# EAGLE design power_indicator_right (EAGLE 7.3.0)
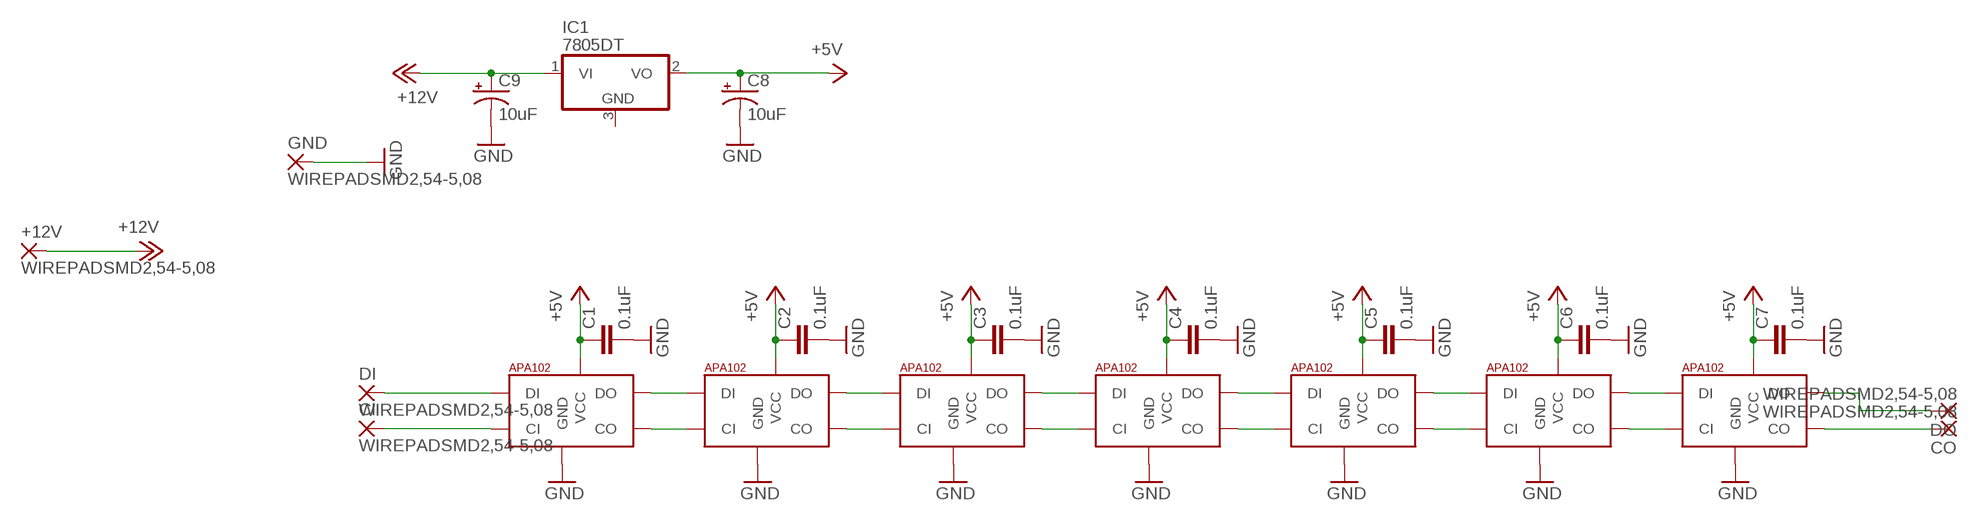
[diagram p0: schematic, sheet 1]

## Parts
+12V  WIREPADSMD2,54-5,08  [SMD2,54-5,08]
C1  0.1uF  0.1UF-100V-10%(0603)  [0603-CAP]
C2  0.1uF  0.1UF-100V-10%(0603)  [0603-CAP]
C3  0.1uF  0.1UF-100V-10%(0603)  [0603-CAP]
C4  0.1uF  0.1UF-100V-10%(0603)  [0603-CAP]
C5  0.1uF  0.1UF-100V-10%(0603)  [0603-CAP]
C6  0.1uF  0.1UF-100V-10%(0603)  [0603-CAP]
C7  0.1uF  0.1UF-100V-10%(0603)  [0603-CAP]
C8  10uF  10UF-TANT  [EIA3216]
C9  10uF  10UF-TANT  [EIA3216]
CI  WIREPADSMD2,54-5,08  [SMD2,54-5,08]
CO  WIREPADSMD2,54-5,08  [SMD2,54-5,08]
DI  WIREPADSMD2,54-5,08  [SMD2,54-5,08]
DO  WIREPADSMD2,54-5,08  [SMD2,54-5,08]
GND  WIREPADSMD2,54-5,08  [SMD2,54-5,08]
IC1  7805DT  [TO252]
U$1  APA1025050  [APA102_5050]
U$2  APA1025050  [APA102_5050]
U$3  APA1025050  [APA102_5050]
U$4  APA1025050  [APA102_5050]
U$5  APA1025050  [APA102_5050]
U$6  APA1025050  [APA102_5050]
U$7  APA1025050  [APA102_5050]

## Nets
+5V: C1.1 C2.1 C3.1 C4.1 C5.1 C6.1 C7.1 C8.A(+) IC1.2(VO) U$1.1(VCC) U$2.1(VCC) U$3.1(VCC) U$4.1(VCC) U$5.1(VCC) U$6.1(VCC) U$7.1(VCC)
+12V: +12V.1(P) C9.A(+) IC1.1(VI)
GND: C1.2 C2.2 C3.2 C4.2 C5.2 C6.2 C7.2 C8.C(-) C9.C(-) GND.1(P) U$1.6(GND) U$2.6(GND) U$3.6(GND) U$4.6(GND) U$5.6(GND) U$6.6(GND) U$7.6(GND)
N$1: U$1.2(CO) U$2.5(CI)
N$2: U$1.3(DO) U$2.4(DI)
N$3: U$2.2(CO) U$3.5(CI)
N$4: U$2.3(DO) U$3.4(DI)
N$5: U$3.2(CO) U$4.5(CI)
N$6: U$3.3(DO) U$4.4(DI)
N$7: U$4.2(CO) U$5.5(CI)
N$8: U$4.3(DO) U$5.4(DI)
N$9: U$5.2(CO) U$6.5(CI)
N$10: U$5.3(DO) U$6.4(DI)
N$11: U$6.2(CO) U$7.5(CI)
N$12: U$6.3(DO) U$7.4(DI)
N$13: CO.1(P) U$7.2(CO)
N$14: DO.1(P) U$7.3(DO)
N$15: DI.1(P) U$1.4(DI)
N$16: CI.1(P) U$1.5(CI)
Unconnected: IC1.3(GND)

## Library data of the parts
+12V CI CO DI DO GND = wirepad:WIREPAD: Wire PAD connect wire on PCB
C1-C7 = SparkFun-Capacitors:0.1UF-100V-10%(0603): CAP-08390; PROD_ID: CAP-08390
C8 C9 = SparkFun-Retired:10UF-TANT: 10uF Tantalum SMT CAP-00811- 16V 10% (EIA-3216); PROD_ID: CAP-00811
IC1 = linear:78*: Positive VOLTAGE REGULATOR Source: http://cache.national.com/ds/LM/LM78L05.pdf http://www.fairchildsemi.com/ds/LM/LM7805.pdf
U$1-U$7 = jos-ph:APA102: APA102C 5050 RGB LED -- Adafruit DotStar Single LED Pixel Product Page: https://www.adafruit.com/products/2343 Datasheet: https://cdn-shop.adafruit.com/product-files/2343/APA102C.pdf

## Board
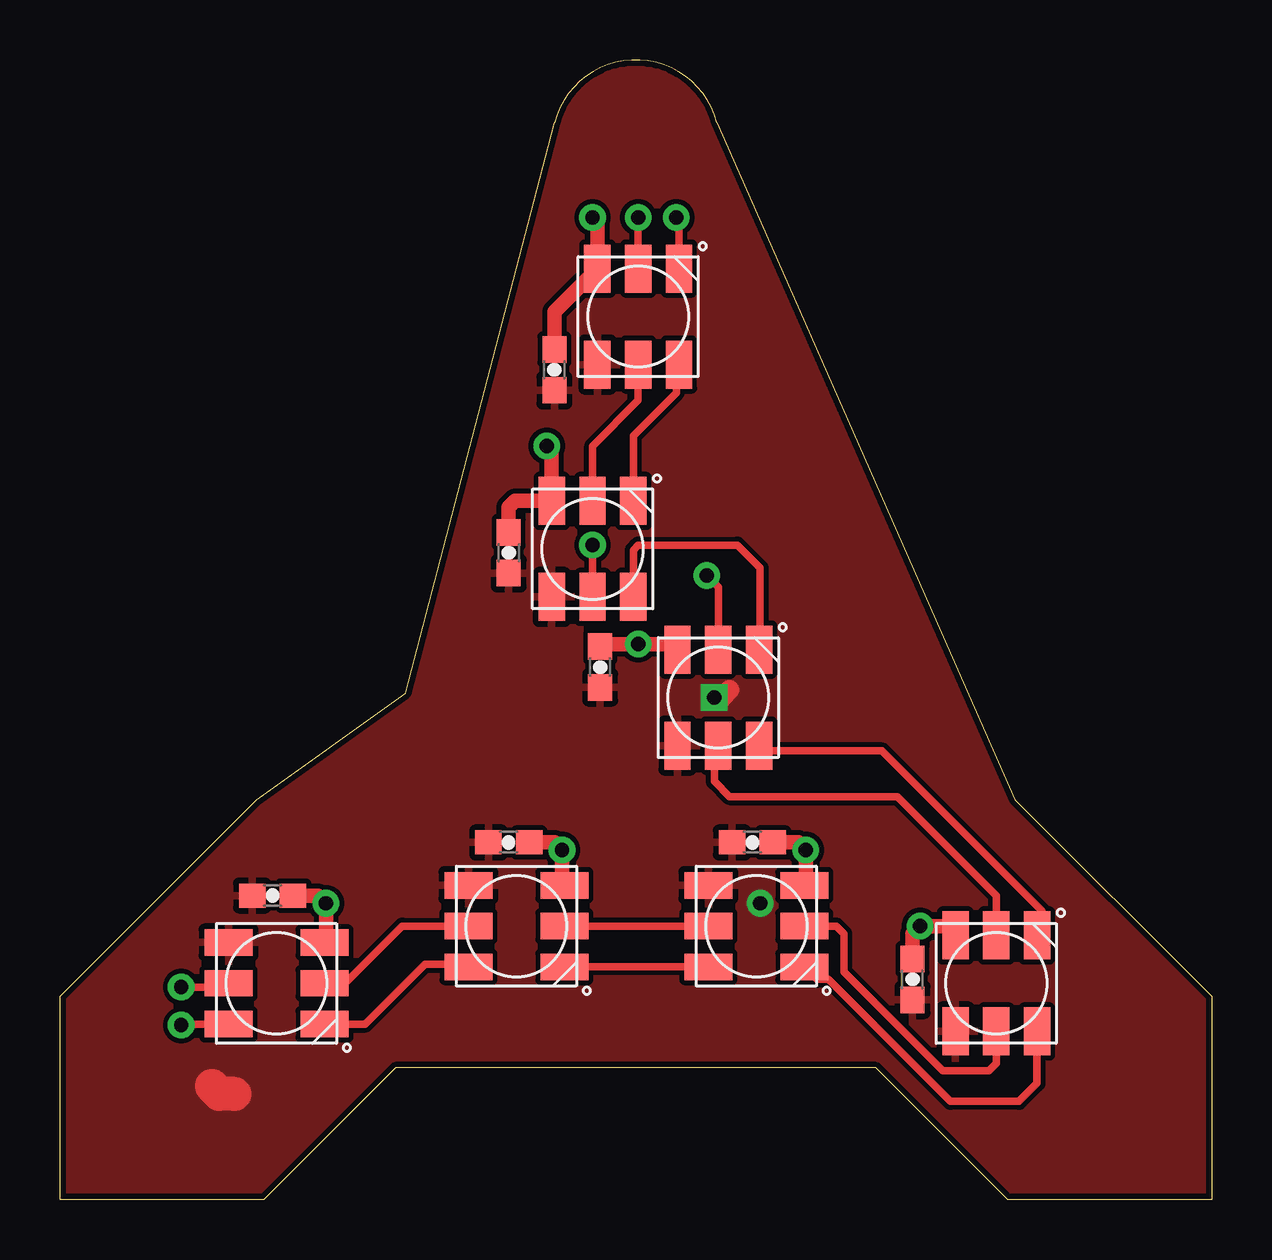
[diagram p1: board, top side]
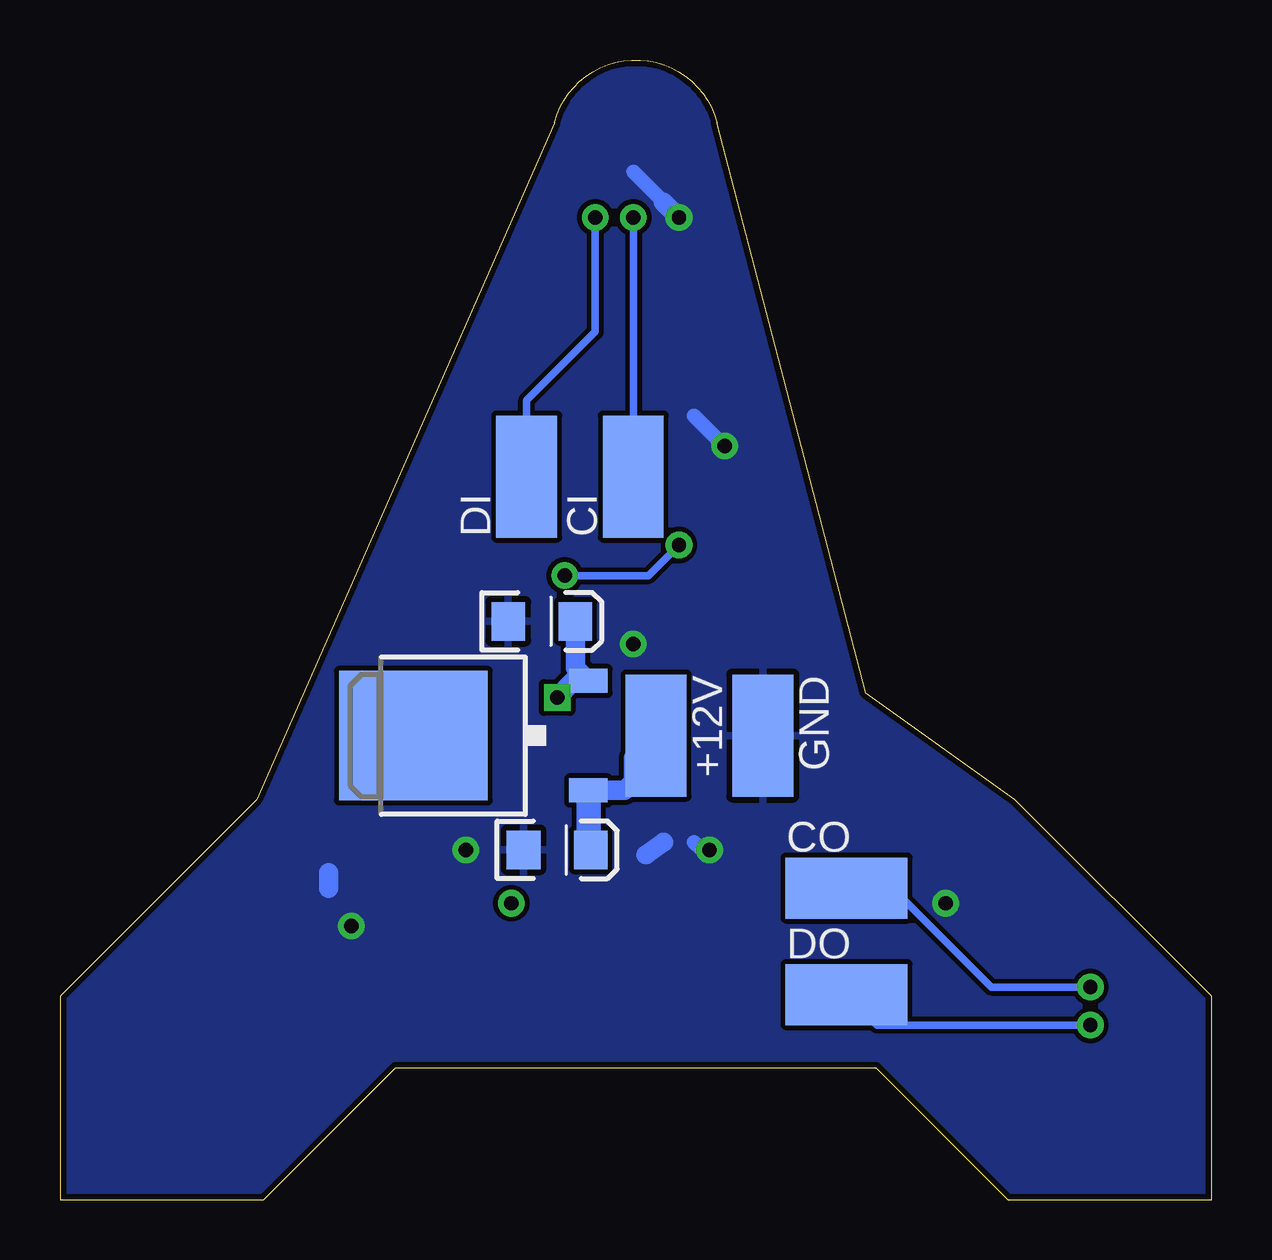
[diagram p2: board, bottom side, seen from below]

Size 48 x 47.5 mm. Coordinates in mm from the lower left corner, seen from the top.
Outline: 27.39,44.88 arc151 20.61,44.88 14.4,21.11 8.19,16.68 0,8.48 0,0 8.48,0 13.98,5.5 34.01,5.5 39.51,0 48,0 48,8.48 39.81,16.68 27.39,44.88
Copper layers (1*16): Top 0.035mm / dielectric 1.5mm / Bottom 0.035mm
Design rules "SparkFun": minimum track width 8mil, minimum drill 20mil, track to track 8mil, track to pad 8mil, pad to pad 8mil, via to via 8mil, smd to smd 8mil, copper to edge 10mil, drill to drill 8mil, minimum pad ring 12mil, minimum via ring 10mil, stop-mask expansion 4mil, vias tented up to drill 25mil, thermal gap 10mil

### Footprints (pad centres in the part's own frame; a part is rotated, then mirrored left to right if it is on the bottom)
SMD2,54-5,08 = smd 2.54 x 5.08: 1 0,0
0603-CAP = smd 1.1 x 1: 1 -0.85,0; 2 0.85,0
EIA3216 = smd 1.4 x 1.6: A 1.4,0; C -1.4,0
TO252 = smd 1 x 1.6: 1 -2.28,-4.8; 2 2.28,-4.8 | smd 5.4 x 6.2: 3 0,2.5
APA102_5050 = smd 2 x 1.1: 1 2,-1.7; 2 2,0; 3 2,1.7; 4 -2,1.7; 5 -2,0; 6 -2,-1.7

### Placement (x,y rotation side)
+12V  23.15,19.34 180 bottom
C1  20.61,34.58 90 top
C2  18.71,26.96 90 top
C3  22.52,22.2 90 top
C4  35.53,9.19 90 top
C5  28.87,14.9 0 top
C6  18.71,14.9 0 top
C7  8.86,12.68 0 top
C8  27.91,24.11 0 bottom
C9  27.28,14.58 0 bottom
CI  24.1,30.14 0 bottom
CO  15.21,13 270 bottom
DI  28.55,30.14 0 bottom
DO  15.21,8.55 270 bottom
GND  18.71,19.34 180 bottom
IC1  30.77,19.34 90 bottom
U$1  24.1,36.81 270 top
U$2  22.2,27.12 270 top
U$3  27.44,20.93 270 top
U$4  39.03,9.03 270 top
U$5  29.03,11.41 180 top
U$6  19.02,11.41 180 top
U$7  9.02,9.03 180 top

### Tracks (layer width: path | path; a pad name or v marks a point on that pad's centre or on a via)
+5V  (via drill 0.6)
  Top 0.813: v27.28,20.93 27.6,20.93 27.91,21.25
  Top 1.422: 7.28,4.42 6.64,4.42 6.32,4.74
  Bottom 0.813: C8.A 26.51,22.17 IC1.2 26.59,21.62 v27.28,20.93
  other vias: 29.18,12.36
  pour Top: 49.25,49.44 -1.04,49.44 -0.79,-0.59 49.25,-0.85
+12V
  Bottom 0.813: IC1.1 24.48,17.07 24.1,17.44 24.1,18.39 +12V.1
  Bottom 1.016: IC1.1 25.97,14.68 C9.A
GND  (via drill 0.6)
  Top 0.61: 9.82,12.68 10.77,12.68 v11.09,12.36 11.09,10.79 U$7.6 | C6.2 20.61,14.9 v20.93,14.58 20.93,13.2 U$6.6 | C5.2 30.77,14.9 v31.09,14.58 31.09,13.17 U$5.6 | C4.2 35.53,11.09 v35.85,11.41 36.94,11.41 U$4.6 | C1.2 20.61,37.01 U$1.6 22.4,40.73 v22.2,40.93 | v20.29,31.41 20.5,31.21 U$2.6 18.96,29.12 18.71,28.87 C2.2 | C3.2 22.62,23.16 v24.1,23.16 25.51,23.16 U$3.6
  Top 0.813: C7.2 9.82,12.68
  Bottom 0.61: v20.29,31.41 21.56,32.68 | v20.93,14.58 21.25,14.58 21.56,14.9 | v22.2,40.93 24.1,42.84
  Bottom 0.813: v22.2,40.93 22.83,41.57 | 36.8,13 36.8,13.63 | 23.58,14.38 22.83,14.9
  pour Bottom: 49.25,49.44 -1.04,49.44 -0.79,-0.59 49.25,-0.85
N$1
  Top 0.305: U$2.5 22.2,31.41 24.1,33.31 U$1.2
N$2
  Top 0.305: U$2.4 23.9,31.84 25.69,33.63 25.69,34.69 U$1.3
N$3  (via drill 0.6)
  Top 0.305: U$3.5 27.44,25.54 v26.96,26.01 | v22.2,27.28 U$2.2
  Bottom 0.305: v26.96,26.01 23.47,26.01 v22.2,27.28
N$4
  Top 0.305: 29.18,23.79 29.18,23.14 U$3.4 29.18,22.98 29.18,26.33 28.23,27.28 24.1,27.28 23.9,27.08 U$2.3
N$5
  Top 0.305: U$3.2 27.28,18.07 27.28,17.44 27.91,16.8 34.9,16.8 39.03,12.68 U$4.5 38.71,11.19
N$6
  Top 0.305: U$4.4 40.93,11.07 40.93,12.04 34.26,18.71 29.36,18.71 U$3.3
N$7
  Top 0.305: U$4.2 39.03,5.69 38.71,5.38 36.8,5.38 32.68,9.5 32.68,11.09 32.36,11.41 U$5.5 | U$5.5 30.77,11.41 30.45,11.09 30.71,11.09 U$5.5
N$8
  Top 0.305: U$4.3 40.73,4.85 39.98,4.11 37.12,4.11 32.04,9.19 31.55,9.19 U$5.4
N$9
  Top 0.305: U$5.2 U$6.5
N$10
  Top 0.305: U$5.3 U$6.4 | U$6.4 20.41,9.71 20.29,9.82 20.91,9.82 U$6.4
N$11
  Top 0.305: U$7.5 11.88,9.03 14.26,11.41 U$6.2
N$12
  Top 0.305: U$7.4 12.72,7.33 15.21,9.82 16.91,9.82 U$6.3
N$13  (via drill 0.6)
  Top 0.305: v5.05,8.87 6.86,8.87 U$7.2
  Bottom 0.305: CO.1 14.58,13.63 13.94,13.63 9.18,8.87 v5.05,8.87
N$14  (via drill 0.6)
  Top 0.305: U$7.3 5.1,7.33 v5.05,7.28
  Bottom 0.305: v5.05,7.28 13.94,7.28 DO.1
N$15  (via drill 0.6)
  Top 0.305: 25.8,38.6 U$1.4 25.8,40.82 v25.69,40.93
  Bottom 0.305: v25.69,40.93 25.69,36.17 28.55,33.31 DI.1
N$16  (via drill 0.6)
  Top 0.305: U$1.5 v24.1,40.93
  Bottom 0.305: v24.1,40.93 CI.1